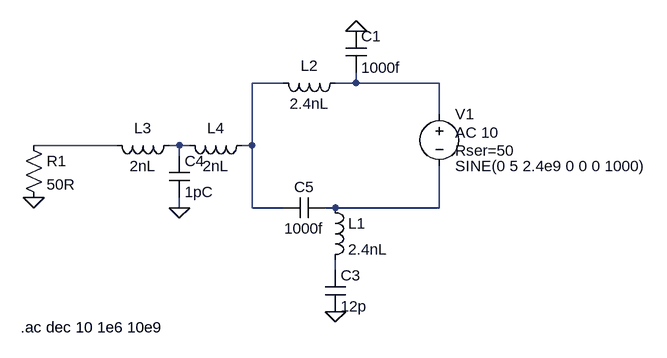
[diagram p0: schematic Balun_Filter.asc]
Balun_Filter.asc, the LTspice schematic file:
Version 4
SHEET 1 936 680
WIRE 112 -128 64 -128
WIRE 224 -128 224 -144
WIRE 224 -128 192 -128
WIRE 352 -128 224 -128
WIRE 352 -80 352 -128
WIRE -144 -32 -272 -32
WIRE -48 -32 -64 -32
WIRE -32 -32 -48 -32
WIRE 64 -32 64 -128
WIRE 64 -32 48 -32
WIRE -48 -16 -48 -32
WIRE -48 64 -48 48
WIRE 64 64 64 -32
WIRE 112 64 64 64
WIRE 192 64 176 64
WIRE 352 64 352 0
WIRE 352 64 192 64
WIRE 192 160 192 144
FLAG 192 224 0
FLAG 224 -208 0
FLAG -48 64 0
FLAG -272 48 0
SYMBOL ind 176 48 R0
SYMATTR InstName L1
SYMATTR Value 2.4nL
SYMBOL ind 208 -144 R90
WINDOW 0 5 56 VBottom 2
WINDOW 3 32 56 VTop 2
SYMATTR InstName L2
SYMATTR Value 2.4nL
SYMBOL cap 208 -208 R0
SYMATTR InstName C1
SYMATTR Value 1000f
SYMATTR SpiceLine V=50 Irms=0 Rser=0.372413 Lser=342.487p mfg="Wьrth Elektronik" pn="885012005049 WCAP-CSGP 0402" type="NP0"
SYMBOL cap 176 160 R0
SYMATTR InstName C3
SYMATTR Value 12p
SYMATTR SpiceLine V=25 Irms=0 Rser=0 Lser=0 mfg="Murata" pn="GRM0335C1E120JA01" type="C0G"
SYMBOL ind -48 -48 R90
WINDOW 0 5 56 VBottom 2
WINDOW 3 32 56 VTop 2
SYMATTR InstName L3
SYMATTR Value 2nL
SYMBOL cap -64 -16 R0
SYMATTR InstName C4
SYMATTR Value 1pC
SYMBOL voltage 352 -96 R0
WINDOW 123 24 44 Left 2
WINDOW 39 24 72 Left 2
SYMATTR InstName V1
SYMATTR Value SINE(0 5 2.4e9 0 0 0 1000)
SYMATTR Value2 AC 10
SYMATTR SpiceLine Rser=50
SYMBOL res -288 -48 R0
SYMATTR InstName R1
SYMATTR Value 50R
SYMBOL ind 64 -48 R90
WINDOW 0 5 56 VBottom 2
WINDOW 3 32 56 VTop 2
SYMATTR InstName L4
SYMATTR Value 2nL
SYMBOL cap 176 48 R90
WINDOW 0 0 32 VBottom 2
WINDOW 3 32 32 VTop 2
SYMATTR InstName C5
SYMATTR Value 1000f
SYMATTR SpiceLine V=50 Irms=0 Rser=0.372413 Lser=342.487p mfg="Wьrth Elektronik" pn="885012005049 WCAP-CSGP 0402" type="NP0"
TEXT -292 248 Left 2 !.ac dec 10 1e6 10e9

The netlist it stands for:
* Balun_Filter.asc
L1 N005 N006 2.4nL
L2 N002 N001 2.4nL
C1 0 N002 1000f V=50 Irms=0 Rser=0.372413 Lser=342.487p mfg="Wьrth Elektronik" pn="885012005049 WCAP-CSGP 0402" type="NP0"
C3 N006 0 12p V=25 Irms=0 Rser=0 Lser=0 mfg="Murata" pn="GRM0335C1E120JA01" type="C0G"
L3 N004 N003 2nL
C4 N004 0 1pC
V1 N002 N005 SINE(0 5 2.4e9 0 0 0 1000) AC 10 Rser=50
R1 N003 0 50R
L4 N001 N004 2nL
C5 N005 N001 1000f V=50 Irms=0 Rser=0.372413 Lser=342.487p mfg="Wьrth Elektronik" pn="885012005049 WCAP-CSGP 0402" type="NP0"
.ac dec 10 1e6 10e9
.backanno
.end